# EAGLE design relay (EAGLE 8.5.0)
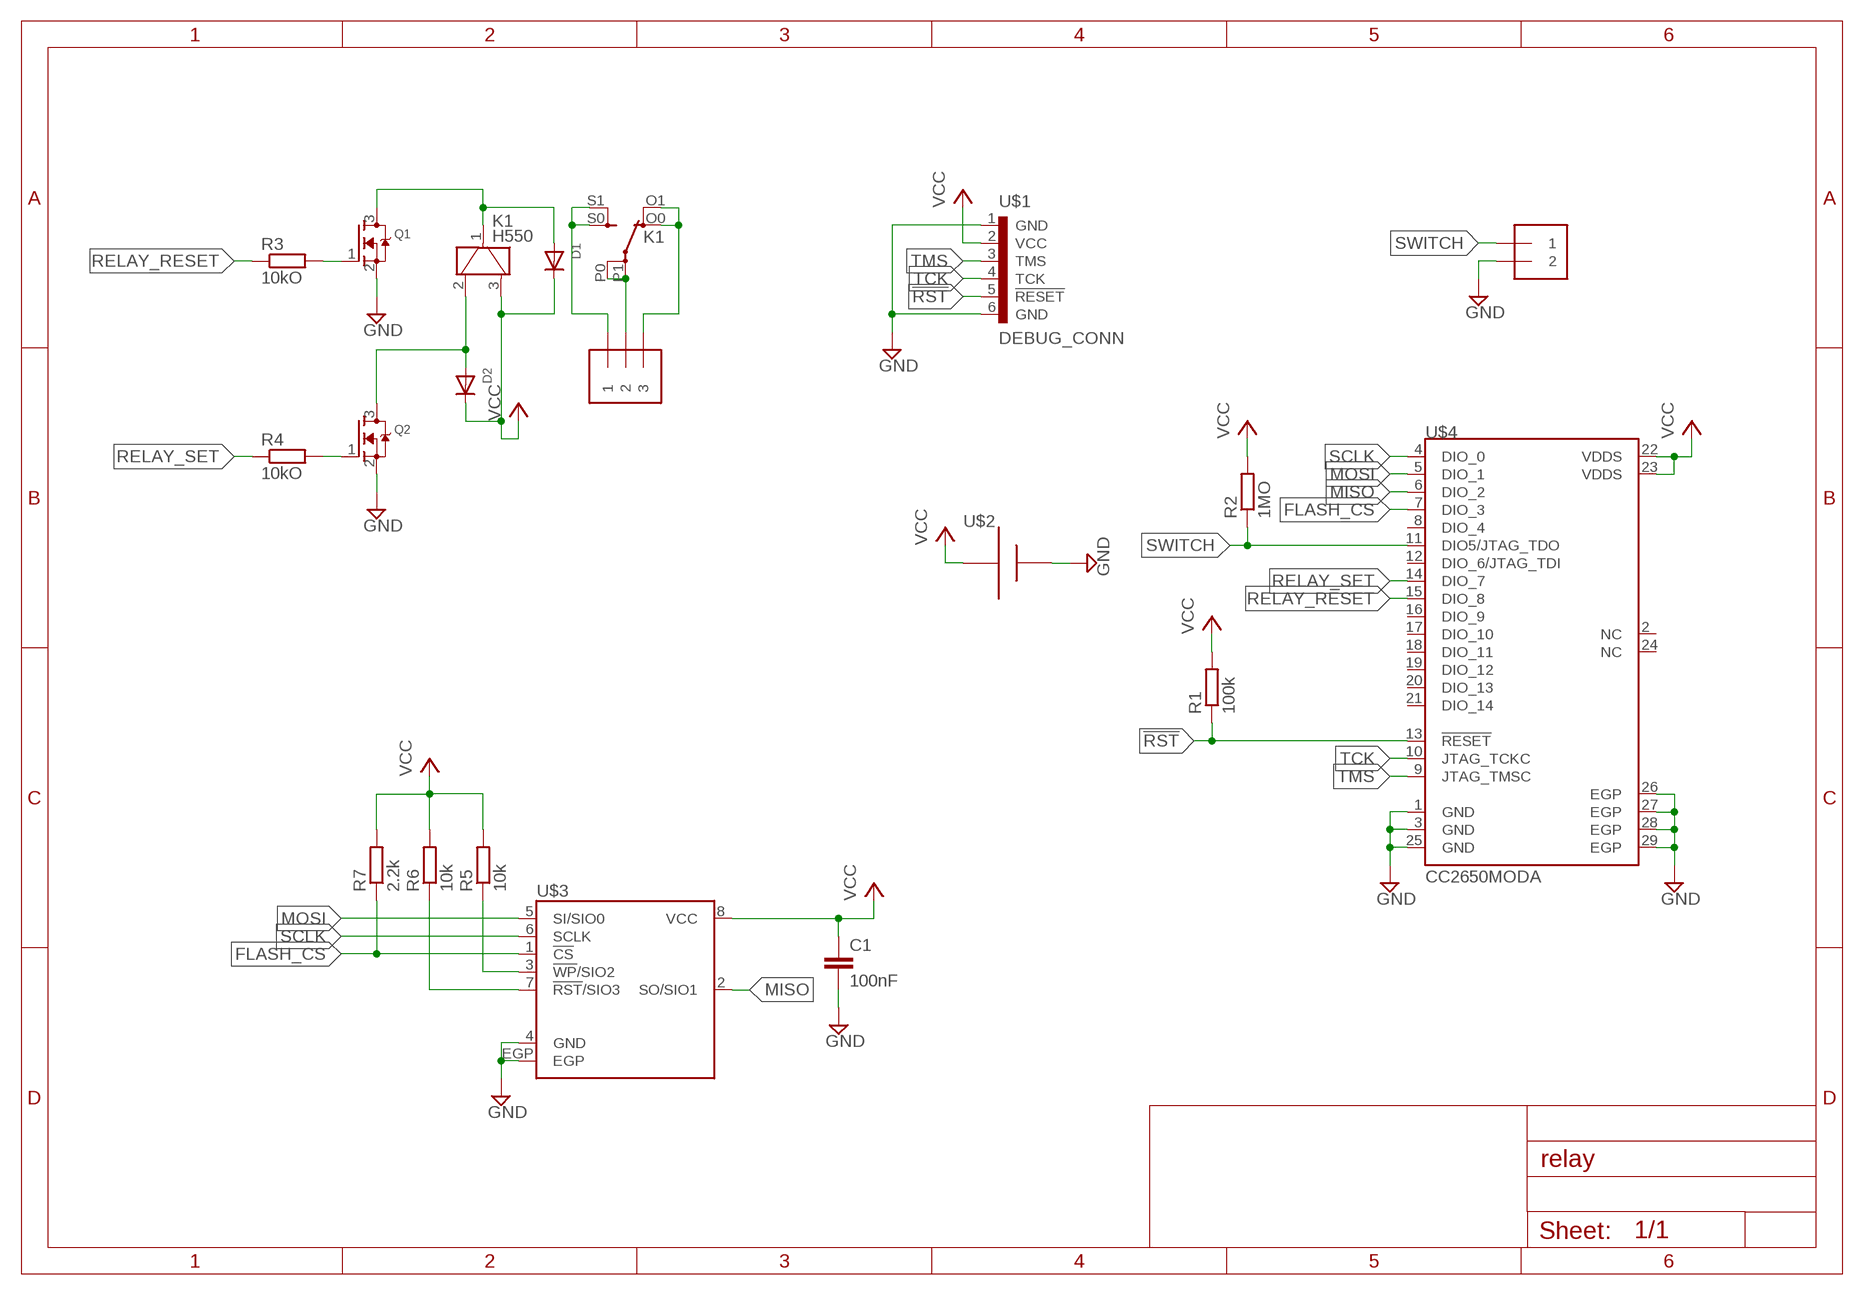
[diagram p0: schematic, sheet 1]

## Parts
C1  100nF  CAPACITOR_0402  [0402]
D1  DIODESOD-123  [SOD-123]
D2  DIODESOD-123  [SOD-123]
J1  1X3-5MM  [1X3-5MM]
J2  1X2-3.5MM  [1X2-3.5MM]
K1  H550  [H550]
Q1  MOSFET-NREFLOW  [SOT23]
Q2  MOSFET-NREFLOW  [SOT23]
R1  100k  RESISTOR_0402  [0402]
R2  1MO  RESISTOR_0402  [0402]
R3  10kO  RESISTOR_0402  [0402]
R4  10kO  RESISTOR_0402  [0402]
R5  10k  RESISTOR_0402  [0402]
R6  10k  RESISTOR_0402  [0402]
R7  2.2k  RESISTOR_0402  [0402]
U$1  DEBUG_CONN  [DEBUG_CONN]
U$2  CR2_SPRINGS  [CR2]
U$3  MX25R8035FMX25R8035FZUIL0  [MX25R8035FZUIL0]
U$4  CC2650MODA  [CC2650MODA]

## Nets
!RST: R1.1 U$1.5(!RESET) U$4.13(!RESET)
FLASH_CS: R7.1 U$3.1(!CS) U$4.7(DIO_3)
GND: C1.2 J2.2 Q1.2(S) Q2.2(S) U$1.1(GND) U$1.6(GND) U$2.- U$2.-@1(-) U$2.-@2(-) U$2.-@3(-) U$3.4(GND) U$3.EGP U$4.1(GND) U$4.3(GND) U$4.25(GND) U$4.26(EGP) U$4.27(EGP) U$4.28(EGP) U$4.29(EGP)
MISO: U$3.2(SO/SIO1) U$4.6(DIO_2)
MOSI: U$3.5(SI/SIO0) U$4.5(DIO_1)
N$1: J1.1 K1.S0(2:S) K1.S1(2:S)
N$2: J1.3 K1.O0(2:O) K1.O1(2:O)
N$3: D1.A K1.1 Q1.3(D)
N$4: D2.A K1.2 Q2.3(D)
N$5: Q1.1(G) R3.2
N$6: Q2.1(G) R4.2
N$7: J1.2 K1.P0(2:P) K1.P1(2:P)
N$8: R5.1 U$3.3(!WP!/SIO2)
N$9: R6.1 U$3.7(!RST!/SIO3)
RELAY_RESET: R3.1 U$4.15(DIO_8)
RELAY_SET: R4.1 U$4.14(DIO_7)
SCLK: U$3.6(SCLK) U$4.4(DIO_0)
SWITCH: J2.1 R2.1 U$4.11(DIO5/JTAG_TDO)
TCK: U$1.4(TCK) U$4.10(JTAG_TCKC)
TMS: U$1.3(TMS) U$4.9(JTAG_TMSC)
VCC: C1.1 D1.C D2.C K1.3 R1.2 R2.2 R5.2 R6.2 R7.2 U$1.2(VCC) U$2.+ U$2.+@1(+) U$2.+@2(+) U$2.+@3(+) U$3.8(VCC) U$4.22(VDDS) U$4.23(VDDS)
Unconnected: U$4.2(NC) U$4.8(DIO_4) U$4.12(DIO_6/JTAG_TDI) U$4.16(DIO_9) U$4.17(DIO_10) U$4.18(DIO_11) U$4.19(DIO_12) U$4.20(DIO_13) U$4.21(DIO_14) U$4.24(NC)

## Library data of the parts
C1 = mine:CAPACITOR
D1 D2 = adafruit:DIODE: Diode SMADIODE - SMA Surface Mount Package 20V 1A Schottky Diode Digikey: 641-1014-6-ND DO-1N4148 - Through Hole Small Current Diode SOD-123 20V 1 A (.5mV Vf) Schottky Diode - Digikey: MBRX120TPMSCT-ND SOD-323 10V 570mA (.38mV Vf, 3ns) Schottky Diode - Digikey: ZLLS410CT-ND SOD-523 30V 30mA Schottky Diode (RB751S-40TE61) - Digikey: RB751S-40TE61CT-ND SOT23-R/W - SOT23 Package (R = Solder Paste/Reflow Ovens, W = Hand-Soldering) BAT54Film 40V 300mA - Digikey: 497-7162-1-ND
J1 = mine:1X3-5MM
J2 = adafruit:1X2: 3.5mm Terminal block http://www.ladyada.net/library/pcb/eaglelibrary.html
K1 = relay:H550: RELAY bistable, 1 x switch, high current; OC_FARNELL: unknown; OC_NEWARK: unknown
Q1 Q2 = adafruit:MOSFET-N: N-Channel Mosfet 2N7002E - 60V 260mA SOT23 [Digikey: 2N7002ET1GOSTR-ND] - REEL BSH103 - 30V 850mA SOT23 [Digikey: 568-5013-1-ND]
R1-R7 = mine:RESISTOR
U$1 = mine:DEBUG_CONN
U$2 = mine:CR2_SPRINGS
U$3 = mine:MX25R8035F
U$4 = mine:CC2650MODA

## Board
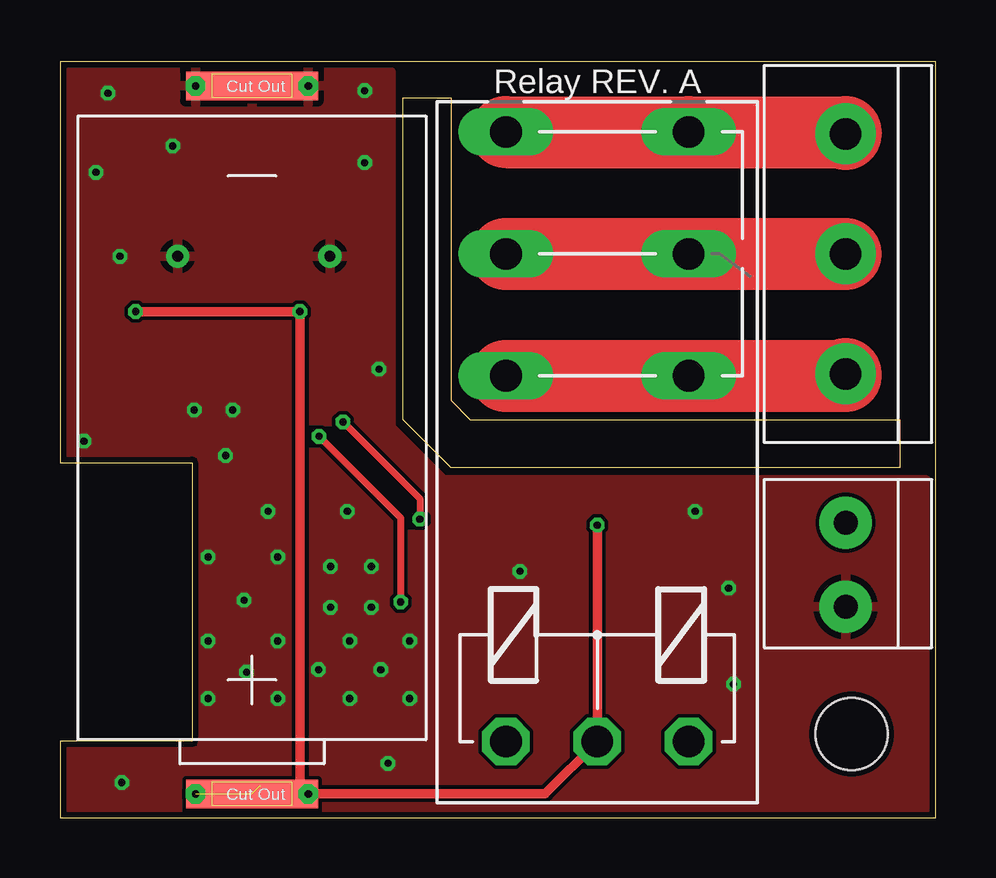
[diagram p1: board, top side]
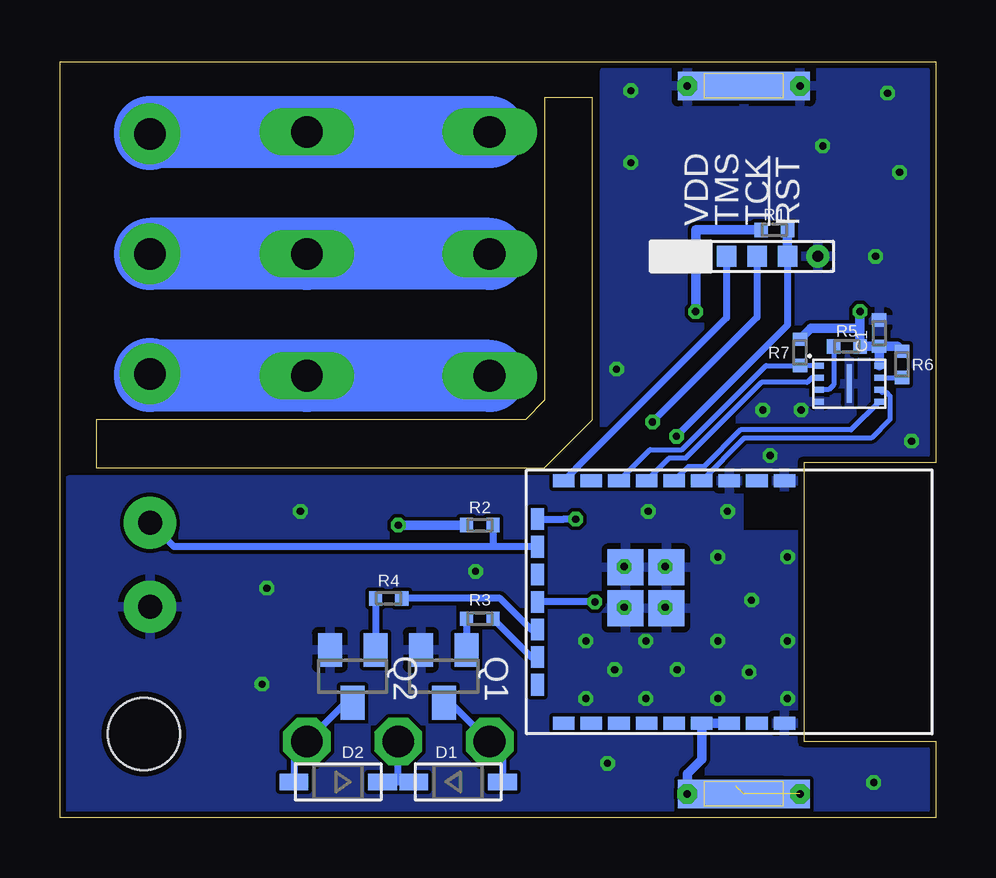
[diagram p2: board, bottom side, seen from below]

Size 36.5 x 31.5 mm. Coordinates in mm from the lower left corner, seen from the top.
Outline: 0,0 36.5,0 36.5,31.5 0,31.5 0,14.8 5.5,14.8 5.5,3.2 0,3.2 0,0
Outline: 35,16.6 35,14.6 16.3,14.6 14.3,16.6 14.3,30 16.3,30 16.3,17.4 17.1,16.6 35,16.6
Copper layers (1*16): Top 0.035mm / dielectric 1.5mm / Bottom 0.035mm
Design rules "SeeedStudio_2layer_DRU_no_angle_20140221 *": minimum track width 6mil, minimum drill 0.3mm, track to track 6mil, track to pad 6mil, pad to pad 6mil, via to via 6mil, smd to smd 0mil, copper to edge 10mil, drill to drill 10mil, minimum pad ring 10mil, minimum via ring 6mil, stop-mask expansion 2mil, vias tented up to drill 100mil, thermal gap 10mil
Holes 3 mm at 33,3.5

### Footprints (pad centres in the part's own frame; a part is rotated, then mirrored left to right if it is on the bottom)
0402 = smd 0.55 x 0.6: 1 -0.55,0; 2 0.55,0
SOD-123 = smd 1.2 x 0.7: A 1.85,0; C -1.85,0
1X3-5MM = drill 1.3 pad 2.54: 1 5,0; 2 0,0; 3 -5,0
1X2-3.5MM = drill 1 pad 2.184: 1 1.8,0; 2 -1.7,0
H550 = drill 1.321 octagon: 1 -7.62,3.81; 2 -7.62,-3.81; 3 -7.62,0 | drill 1.321 long: O0 7.62,3.81; O1 7.62,-3.81; P0 12.7,3.81; P1 12.7,-3.81; S0 17.78,3.81; S1 17.78,-3.81
SOT23 = smd 1 x 1.4: 1 -0.95,-1.1; 2 0.95,-1.1; 3 0,1.1
DEBUG_CONN = drill 0.457: 1 0,3.81; 6 0,-2.54 | smd 0.889 x 0.813: 2 0,2.54; 3 0,1.27; 4 0,0; 5 0,-1.27
CR2 = drill 0.3 octagon: + -2.35,14.75; +@3 2.35,14.75; - -2.35,-14.75; -@3 2.35,-14.75 | smd 5.5 x 1.2: +@1 0,14.75; -@1 0,-14.75 | smd 5.5 x 1.2 bottom: +@2 0,14.75; -@2 0,-14.75
MX25R8035FZUIL0 = smd 0.25 x 0.4: 1 0.75,1.25; 2 0.25,1.25; 3 -0.25,1.25; 4 -0.75,1.25; 5 -0.75,-1.25; 6 -0.25,-1.25; 7 0.25,-1.25; 8 0.75,-1.25 | smd 1.6 x 0.2: EGP 0,0
CC2650MODA = smd 0.55 x 0.9: 1 -5.05,2.3; 2 -5.05,1.15; 3 -5.05,0; 4 -5.05,-1.15; 5 -5.05,-2.3; 6 -5.05,-3.45; 7 -5.05,-4.6; 8 -5.05,-5.75; 9 -5.05,-6.9; 17 5.05,-6.9; 18 5.05,-5.75; 19 5.05,-4.6; 20 5.05,-3.45; 21 5.05,-2.3; 22 5.05,-1.15; 23 5.05,0; 24 5.05,1.15; 25 5.05,2.3 | smd 0.9 x 0.55: 10 -3.45,-8; 11 -2.3,-8; 12 -1.15,-8; 13 0,-8; 14 1.15,-8; 15 2.3,-8; 16 3.45,-8 | smd 1.5 x 1.5: 26 -1.435,-2.625; 27 -1.435,-4.325; 28 0.265,-4.325; 29 0.265,-2.625

### Placement (x,y rotation side)
C1  2.35,20.2 90 bottom
D1  19.9,1.5 0 bottom
D2  24.9,1.5 180 bottom
J1  32.75,23.5 90 top
J2  32.75,10.5 90 top
K1  22.4,10.8 90 top
Q1  20.5,5.9 180 bottom
Q2  24.3,5.9 180 bottom
R1  6.72,24.5 180 bottom
R2  19,12.2 180 bottom
R3  19,8.3 180 bottom
R4  22.8,9.15 180 bottom
R5  3.7,19.65 0 bottom
R6  1.4,18.9 90 bottom
R7  5.65,19.4 90 bottom
U$1  7.44,23.4 90 bottom
U$2  8,15.75 180 top
U$3  3.6,18.1 90 bottom
U$4  8.6,9 270 bottom

### Tracks (layer width: path | path; a pad name or v marks a point on that pad's centre or on a via)
!RST  (via drill 0.3)
  Top 0.3: v10.8,15.9 14.2,12.5 v14.2,9
  Bottom 0.3: U$1.5 6.17,20.53 v10.8,15.9 | v14.2,9 U$4.13
  Bottom 0.4: U$1.5 R1.1
FLASH_CS
  Bottom 0.2: U$4.7 11.9,15.35 10.57,15.35 7.07,18.85 R7.1 U$3.1
GND  (via drill 0.3)
  other vias: 7.2,17 5.6,17 6.9,15.1 1,15.7 12.97,10.47 11.28,10.47 11.28,8.78 12.97,8.78 14.57,7.38 14.57,4.97 13.38,6.17 12.07,4.97 12.07,7.38 10.78,6.17 9.07,7.38 9.07,4.97 6.17,4.97 6.17,7.38 7.78,6.08 7.67,9.07 6.17,10.88 9.07,10.88 8.68,12.78 11.97,12.78 13.3,18.7 12.7,27.3 2.5,23.4 1.5,26.9 4.7,28 2,30.2 12.7,30.3 2.58,1.48 13.68,2.27 26.48,12.78 19.18,10.28 27.88,9.57 28.07,5.58
  pour Bottom: 0.4,31.1 13.8,31.1 13.8,16.3 16,14.1 36.1,14.1 36.1,0.4 0.4,0.4 0.4,2.8 5.9,2.8 5.9,15.2 0.4,15.2
  pour Top: 0.4,31.1 13.8,31.1 13.8,16.3 16,14.1 36.1,14.1 36.1,0.4 0.4,0.4 0.4,2.8 5.9,2.8 5.9,15.2 0.4,15.2
MISO
  Bottom 0.2: U$4.6 11.11,14.99 10.42,14.99 7.27,18.15 5.35,18.15 5.15,18.35 U$3.2
MOSI
  Bottom 0.2: U$4.5 10.31,14.64 9.66,14.64 8.13,16.17 3.53,16.17 U$3.5
N$1
  Top 3: K1.S0 K1.S1 32.75,28.58 J1.1
  Bottom 3: K1.S0 K1.S1 32.75,28.58 J1.1
N$2
  Top 3: K1.O0 K1.O1 32.75,18.42 J1.3
  Bottom 3: K1.O0 K1.O1 32.75,18.42 J1.3
N$3
  Bottom 0.3: D1.A 18.05,2.64 K1.1 20.21,4.8 Q1.3
N$4
  Bottom 0.3: D2.A 26.75,2.64 K1.2 24.59,4.8 Q2.3
N$5
  Bottom 0.3: R3.2 Q1.1
N$6
  Bottom 0.3: R4.2 Q2.1
N$7
  Top 3: K1.P0 K1.P1 J1.2
  Bottom 3: K1.P0 K1.P1 J1.2
N$8
  Bottom 0.2: R5.1 4.25,18.05 4.45,17.85 U$3.3
N$9
  Bottom 0.2: U$3.7 R6.1
RELAY_RESET
  Bottom 0.3: U$4.15 16.85,6.7 R3.1
RELAY_SET
  Bottom 0.3: U$4.14 16.85,7.85 18.15,9.15 R4.1
SCLK
  Bottom 0.2: U$4.4 7.98,15.82 2.68,15.82 1.9,16.6 1.9,17.58 2.04,17.73 2.23,17.73 U$3.6
SWITCH
  Bottom 0.3: U$4.11 18.45,11.3 | 18.45,11.3 31.75,11.3 J2.1 | R2.1 18.45,11.3
TCK  (via drill 0.3)
  Top 0.3: v11.8,16.5 15,13.3 v15,12.45
  Bottom 0.3: U$4.10 15.5,12.45 v15,12.45 | U$1.4 7.44,20.86 v11.8,16.5
TMS
  Bottom 0.3: U$1.3 8.71,20.84 14.92,14.63 14.93,14.63 15.1,14.45 U$4.9
VCC  (via drill 0.3)  (3 unrouted)
  Top 0.4: 10,1.35 8.35,1.35 | 10,1.35 v10,21.1 v3.15,21.1 | 10,1.35 U$2.+ 20.22,1 K1.3 v22.4,12.2
  Bottom 0.3: D1.C 22.4,1.5 | 22.4,1.5 K1.3 | 22.4,1.5 D2.C
  Bottom 0.4: U$4.23 U$4.22 9.75,2.45 10.35,1.85 U$2.+ | R1.2 9.98,24.5 U$1.2 v10,21.1 | v22.4,12.2 R2.2 | C1.1 U$3.8 | C1.1 R5.2 3.15,20.4 | C1.1 1.6,19.65 R6.2 | v3.15,21.1 3.15,20.4 | R7.2 5.2,20.4 3.15,20.4

### Text on the board
tPlace: Relay REV. A